# Altium schematic sheet Motor_Driver.SchDoc
size A4; Organization: Altium Limited; Address1: 3 Minna Close; Address2: Belrose; Address3: NSW 2085; Address4: Australia
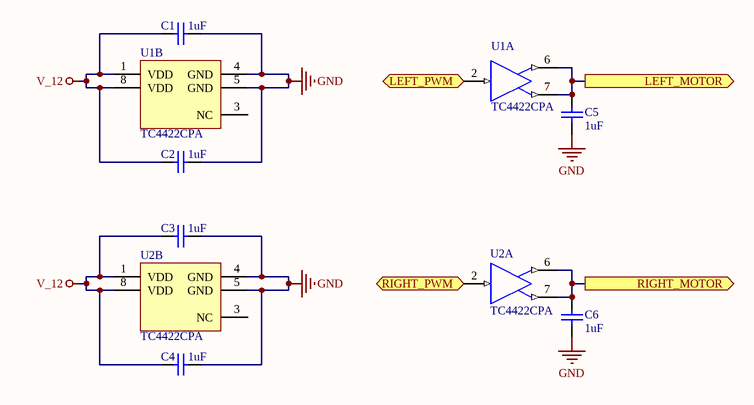
[diagram p0: Motor_Driver.SchDoc]

## Parts
C1  value 1uF  [RAD-0.3]  (hidden comment: Cap)
C2  value 1uF  [RAD-0.3]  (hidden comment: Cap)
C3  value 1uF  [RAD-0.3]  (hidden comment: Cap)
C4  value 1uF  [RAD-0.3]  (hidden comment: Cap)
C5  value 1uF  [RAD-0.3]  (hidden comment: Cap)
C6  value 1uF  [RAD-0.3]  (hidden comment: Cap)
U1  TC4422CPA  [PDIP300-PA8]  (parts A,B of 2)
U2  TC4422CPA  [PDIP300-PA8]  (parts A,B of 2)

## Ports
LEFT_MOTOR (out), LEFT_PWM (in), RIGHT_MOTOR (out), RIGHT_PWM (in)

## Nets
GND: C1.2 C2.2 C3.2 C4.2 C5.1 C6.1 U1.4(GND) U1.5(GND) U2.4(GND) U2.5(GND)
V_12: C1.1 C2.1 C3.1 C4.1 U1.1(VDD) U1.8(VDD) U2.1(VDD) U2.8(VDD)
LEFT_MOTOR: C5.2 U1.6(OUT) U1.7(OUT) ; port LEFT_MOTOR
LEFT_PWM: U1.2(IN) ; port LEFT_PWM
RIGHT_MOTOR: C6.2 U2.6(OUT) U2.7(OUT) ; port RIGHT_MOTOR
RIGHT_PWM: U2.2(IN) ; port RIGHT_PWM

Not connected (* = marked no-connect by the designer): U1 3(NC); U2 3(NC)

## Notes on the sheet
- Title
- Size:
- Date:
- A4
- Number:
- Time:
- Revision:
- Sheet
- of
- File:

## Library data of the parts
C1-C6 = Cap: Capacitor; Published: 8-Jun-2000; LatestRevisionDate: 17-Jul-2002; LatestRevisionNote: Re-released for DXP Platform.; PackageReference: RAD-0.3; Publisher: Altium Limited
U1 U2 = TC4422CPA: 9A High-Speed MOSFET Driver, Non-Inverting, Commercial Temperature; FirstPublished: 29-Jan-2009; DatasheetVersion: revD, Sep-2004; PackageVersion: revBB, Aug-2009; PackageReference: PDIP300-PA8; Publisher: Altium Limited; PackageDescription: 8-Lead Plastic Dual In-Line (PA) - 300 mil Body [PDIP]; Supplier 1: Digi-Key; Supplier Part Number 1: TC4422CPA-ND; Supplier 2: Farnell; Supplier Part Number 2: 1196785; Supplier 3: Farnell; Supplier Part Number 3: 1523810; Code_JEDEC: MS-001-BA; ComponentLink1Description: Datasheet; ComponentLink1URL: http://ww1.microchip.com/downloads/en/DeviceDoc/21420d.pdf; ComponentLink2Description: Packaging Specification; ComponentLink2URL: http://www.microchip.com/stellent/groups/techpub_sg/documents/packagingspec/en012702.pdf; ComponentLink3Description: Microchip.com Home; ComponentLink3URL: http://www.microchip.com/; Supplier 4: Newark; Supplier Part Number 4: 88K1245